# EAGLE design pixel-clock (EAGLE 7.0.0)
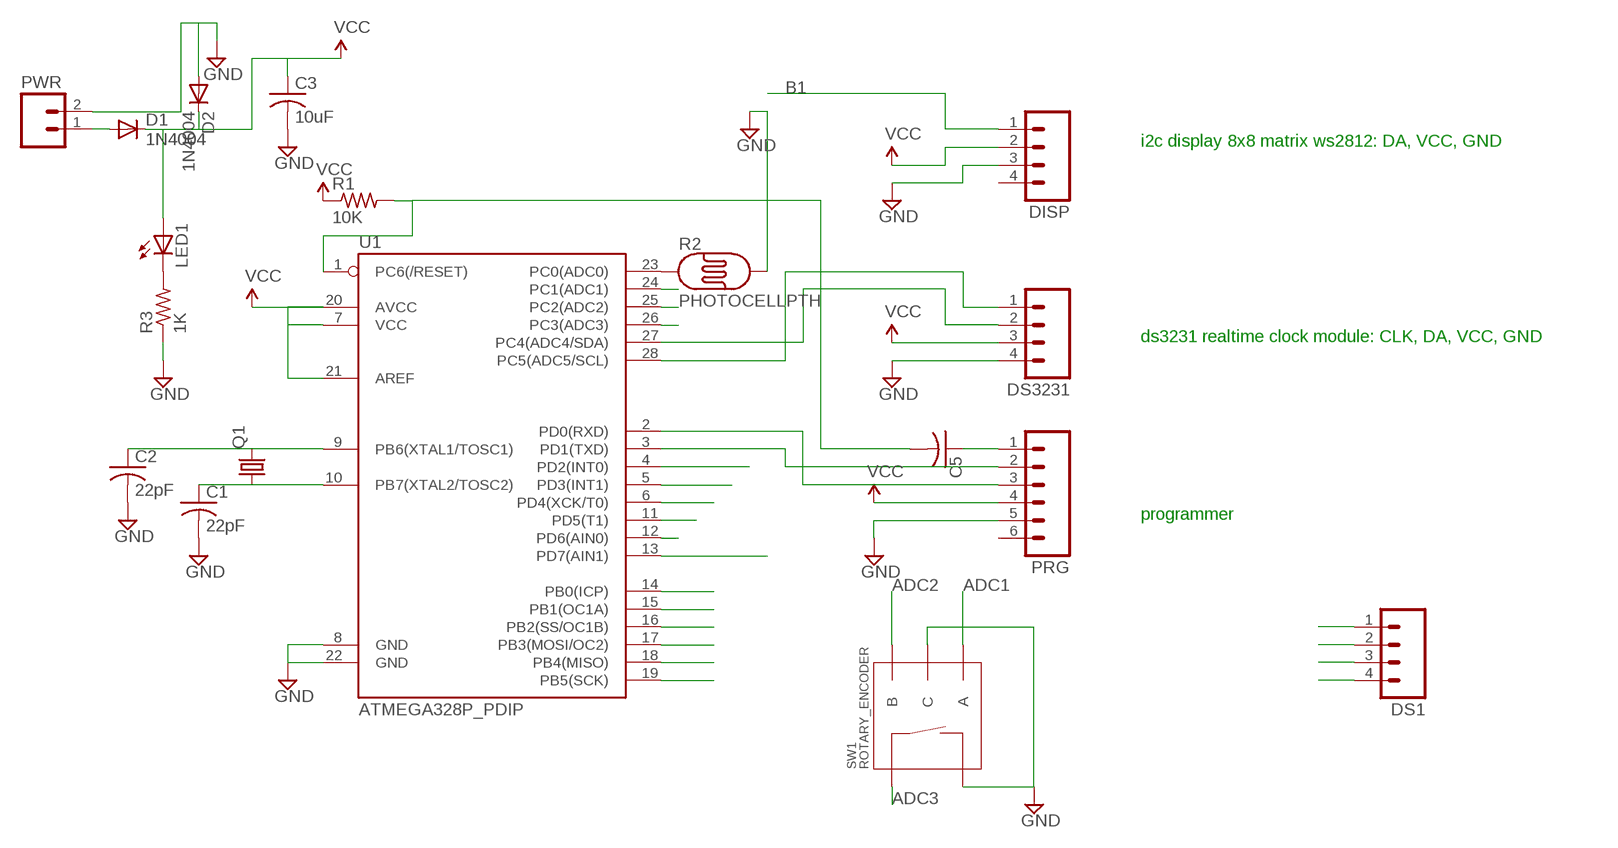
[diagram p0: schematic, sheet 1]

## Parts
C1  22pF  C-US050-024X044  [C050-024X044]
C2  22pF  C-US050-024X044  [C050-024X044]
C3  10uF  C-US025-025X050  [C025-025X050]
C5  C-US025-025X050  [C025-025X050]
D1  1N4004  [DO41-10]
D2  1N4004  [DO41-10]
DISP  M04PTH  [1X04]
DS1  M04PTH  [1X04]
DS3231  M04PTH  [1X04]
LED1  LED3MM  [LED3MM]
PRG  M06SILK_FEMALE_PTH  [1X06]
PWR  M02PTH3  [1X02_LONGPADS]
Q1  CRYSTALHC49S  [HC49/S]
R1  10K  R-US_0207/9  [0207/9]
R2  PHOTOCELLPTH  [PHOTOCELL]
R3  1K  R-US_0207/9  [0207/9]
SW1  ROTARY_ENCODER  [ROTARY_ENC_PLAIN]
U1  ATMEGA328P_PDIP  [DIL28-3]

## Nets
ADC1: SW1.A U1.24(PC1(ADC1))
ADC2: SW1.B U1.25(PC2(ADC2))
ADC3: SW1.SW+ U1.26(PC3(ADC3))
B0: DS1.1 U1.14(PB0(ICP))
B1: DISP.1 U1.15(PB1(OC1A))
B2: U1.16(PB2(SS/OC1B))
B3: U1.17(PB3(MOSI/OC2))
B4: U1.18(PB4(MISO))
B5: U1.19(PB5(SCK))
D0: PRG.3 U1.2(PD0(RXD))
D1: PRG.2 U1.3(PD1(TXD))
D2: U1.4(PD2(INT0))
D3: U1.5(PD3(INT1))
D4: U1.6(PD4(XCK/T0))
D5: U1.11(PD5(T1))
D6: DS1.3 U1.12(PD6(AIN0))
D7: DS1.2 U1.13(PD7(AIN1))
GND: C1.2 C2.2 C3.2 D2.A DISP.3 DS1.4 DS3231.4 PRG.5 PWR.2 R2.2 R3.1 SW1.C SW1.SW- U1.8(GND) U1.22(GND)
N$1: DS3231.1 U1.28(PC5(ADC5/SCL))
N$2: DS3231.2 U1.27(PC4(ADC4/SDA))
N$3: R2.1 U1.23(PC0(ADC0))
N$4: C2.1 Q1.2 U1.9(PB6(XTAL1/TOSC1))
N$5: C1.1 Q1.1 U1.10(PB7(XTAL2/TOSC2))
N$6: D1.A PWR.1
N$7: LED1.K(C) R3.2
N$12: C5.1 PRG.1
N$13: C5.2 R1.2 U1.1(PC6(/RESET))
VCC: C3.1 D1.C D2.C DISP.2 DS3231.3 LED1.A PRG.4 R1.1 U1.7(VCC) U1.20(AVCC) U1.21(AREF)
Unconnected: DISP.4 PRG.6

## Notes on the sheet
- i2c display 8x8 matrix ws2812: DA, VCC, GND
- ds3231 realtime clock module: CLK, DA, VCC, GND
- programmer

## Library data of the parts
C1-C3 C5 = adafruit:C-US: CAPACITOR, American symbol
D1 D2 = adafruit:1N4004: DIODE General purpose 1N400x type rectifier (With bigger pads) http://www.ladyada.net/library/pcb/eaglelibrary.html
DISP DS1 DS3231 = SparkFun-Connectors:M04: Header 4 Standard 4-pin 0.1" header. Use with straight break away headers (SKU : PRT-00116), right angle break away headers (PRT-00553), swiss pins (PRT-00743), machine pins (PRT-00117), and female headers (PRT-00115). Molex polarized connector foot print use with SKU : PRT-08231 with associated crimp pins and housings. 1MM SMD Version SKU: PRT-10208
LED1 = adafruit:LED: LED OSRAM: - CHIPLED LG R971, LG N971, LY N971, LG Q971, LY Q971, LO R971, LY R971 LH N974, LH R974 LS Q976, LO Q976, LY Q976 LO Q996 - Hyper CHIPLED LW Q18S LB Q993, LB Q99A, LB R99A - SideLED LS A670, LO A670, LY A670, LG A670, LP A670 LB A673, LV A673, LT A673, LW A673 LH A674 LY A675 LS A676, LA A676, LO A676, LY A676, LW A676 LS A679, LY A679, LG A679 - Hyper Micro SIDELED® LS Y876, LA Y876, LO Y876, LY Y876 LT Y87S - SmartLED LW L88C, LW L88S LB L89C, LB L89S, LG L890 LS L89K, LO L89K, LY L89K LS L896, LA L896, LO L896, LY L896 - TOPLED LS T670, LO T670, LY T670, LG T670, LP T670 LSG T670, LSP T670, LSY T670, LOP T670, LYG T670 LG T671, LOG T671, LSG T671 LB T673, LV T673, LT T673, LW T673 LH T674 LS T676, LA T676, LO T676, LY T676, LB T676, LH T676, LSB T676, LW T676 LB T67C, LV T67C, LT T67C, LS T67K, LO T67K, LY T67K, LW E67C LS E67B, LA E67B, LO E67B, LY E67B, LB E67C, LV E67C, LT E67C LW T67C LS T679, LY T679, LG T679 LS T770, LO T770, LY T770, LG T770, LP T770 LB T773, LV T773, LT T773, LW T773 LH T774 LS E675, LA E675, LY E675, LS T675 LS T776, LA T776, LO T776, LY T776, LB T776 LHGB T686 LT T68C, LB T68C - Hyper Mini TOPLED® LB M676 - Mini TOPLED Santana® LG M470 LS M47K, LO M47K, LY M47K Source: http://www.osram.convergy.de/
PRG = jack-eagle:M06: Header 6 Standard 6-pin 0.1" header. Use with straight break away headers (SKU : PRT-00116), right angle break away headers (PRT-00553), swiss pins (PRT-00743), machine pins (PRT-00117), and female headers (PRT-00115). Molex polarized connector foot print use with SKU : PRT-08094 with associated crimp pins and housings. NOTES ON THE VARIANTS LOCK and LOCK_LONGPADS... This footprint was designed to help hold the alignment of a through-hole component (i.e. 6-pin header) while soldering it into place. You may notice that each hole has been shifted either up or down by 0.005 of an inch from it's more standard position (which is a perfectly straight line). This slight alteration caused the pins (the squares in the middle) to touch the edges of the holes. Because they are alternating, it causes a "brace" to hold the component in place. 0.005 has proven to be the perfect amount of "off-center" position when using our standard breakaway headers. Although looks a little odd when you look at the bare footprint, once you have a header in there, the alteration is very hard to notice. Also,if you push a header all the way into place, it is covered up entirely on the bottom side. This idea of altering the position of holes to aid alignment will be further integrated into the Sparkfun Library for other footprints. It can help hold any component with 3 or more connection pins.; PROD_ID: CONN-08437
PWR = SparkFun-Connectors:M02: Standard 2-pin 0.1" header. Use with - straight break away headers ( PRT-00116) - right angle break away headers (PRT-00553) - swiss pins (PRT-00743) - machine pins (PRT-00117) - female headers (PRT-00115) Molex polarized connector foot print use with: PRT-08233 with associated crimp pins and housings. 2.54_SCREWTERM for use with PRT-10571. 3.5mm Screw Terminal footprints for PRT-08084 5mm Screw Terminal footprints for use with PRT-08432
Q1 = adafruit:CRYSTAL: CRYSTAL; OC_FARNELL: 1667008; OC_NEWARK: unknown
R1 R3 = adafruit:R-US_: RESISTOR, American symbol
R2 = SparkFun-Sensors:PHOTOCELL: CdS photoresistor. This is a low cost way to detect light levels. Resistance decreases with more incoming light. SparkFun SKU: SEN-09088
SW1 = jack-eagle:ROTARY_ENCODER: Simple no LED rotary encoder Example: COM-09117
U1 = SparkFun-DigitalIC:ATMEGA328P_PDIP: uC used in the Arduino 32kb flash, 1k EEPROM, 2k SRAM This is the through-hole version of this chip.

## Board
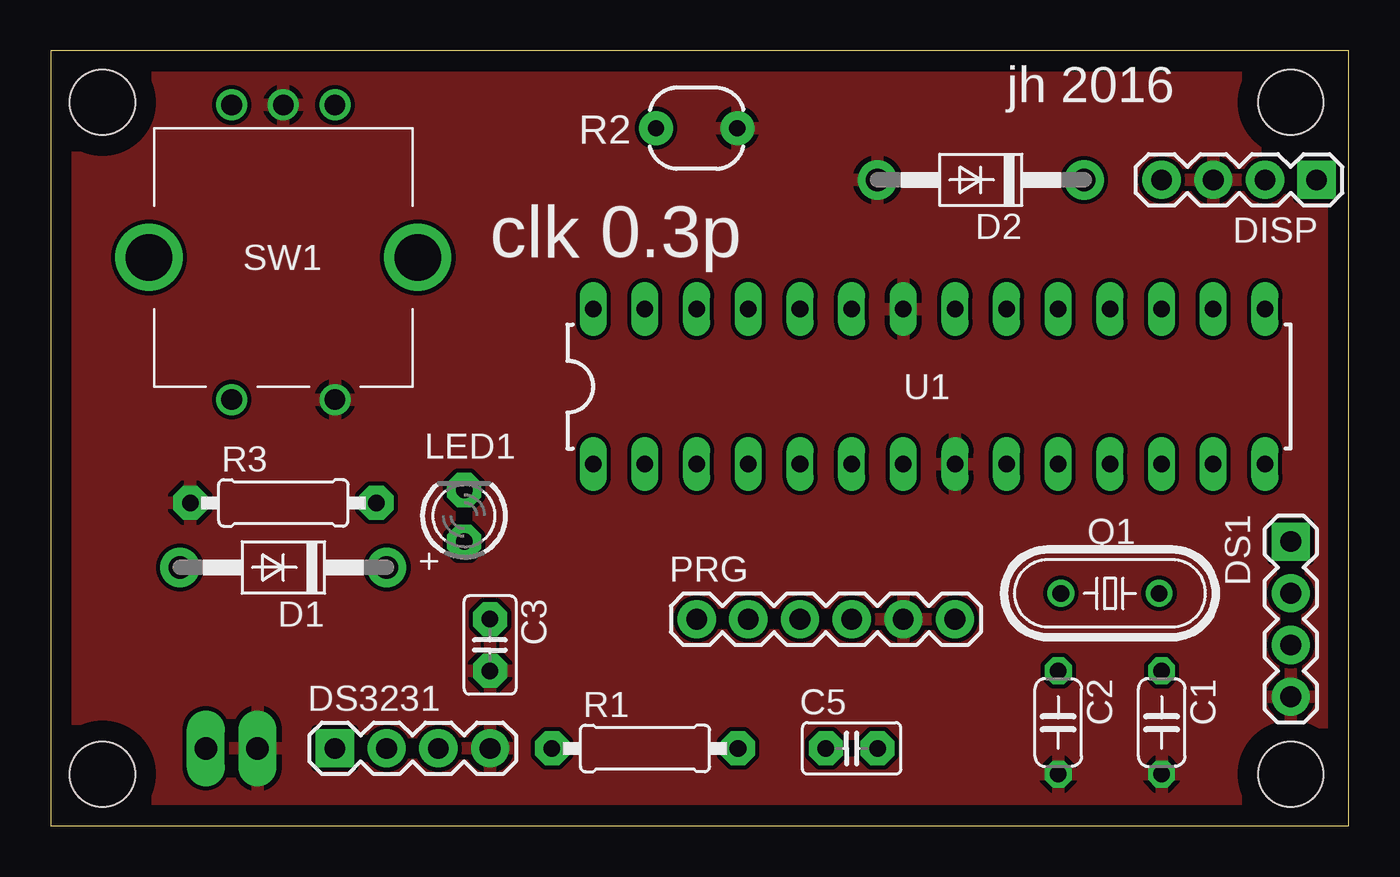
[diagram p1: board, top side]
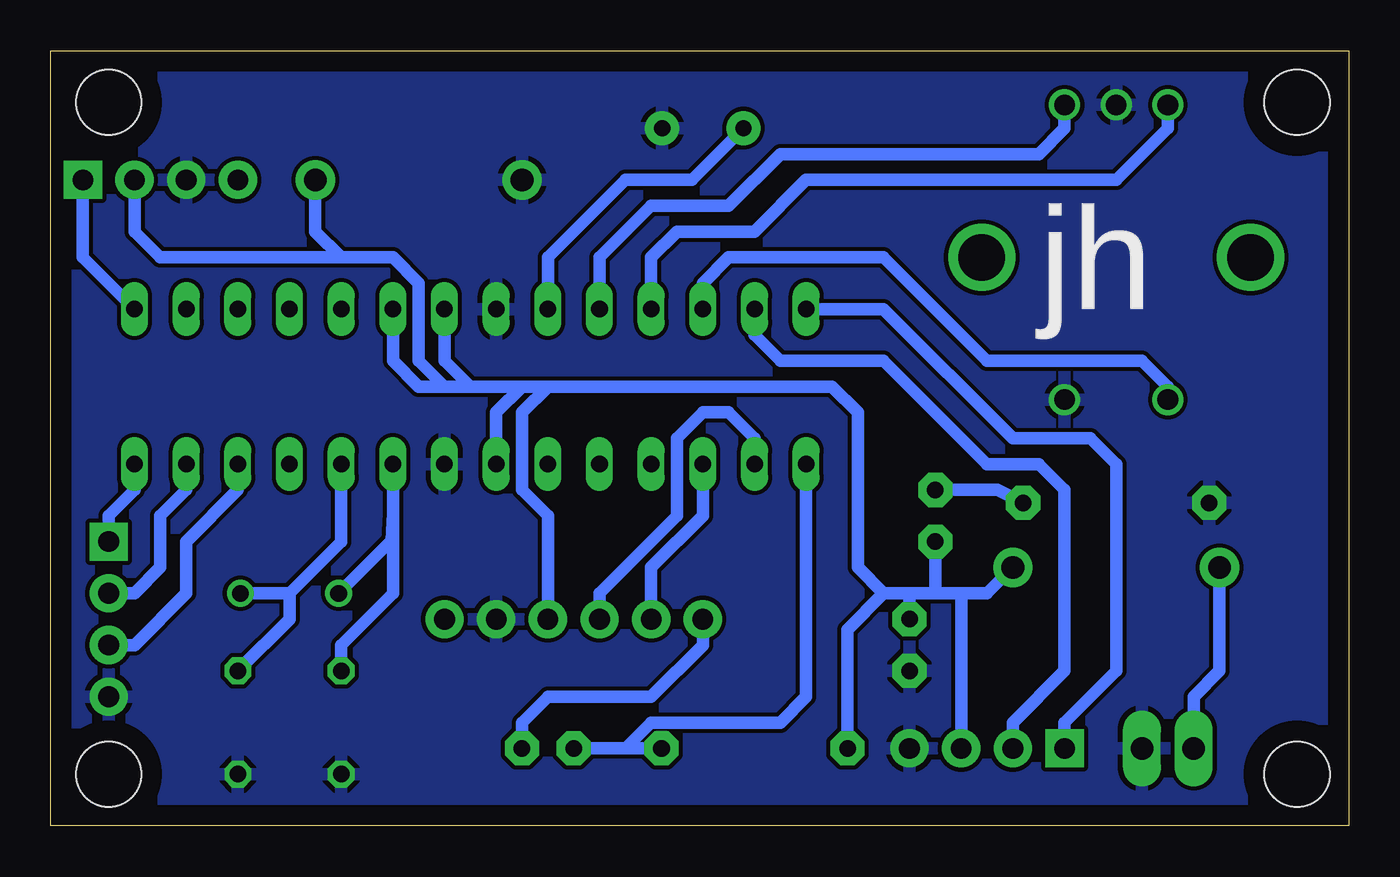
[diagram p2: board, bottom side, seen from below]

Size 63.8 x 38.09 mm. Coordinates in mm from the lower left corner, seen from the top.
Outline: 0,0 63.8,0 63.8,38.09 0,38.09 0,0
Copper layers (1*16): Top 0.035mm / dielectric 1.5mm / Bottom 0.035mm
Design rules "default": minimum track width 10mil, minimum drill 24mil, track to track 8mil, track to pad 8mil, pad to pad 8mil, via to via 8mil, smd to smd 8mil, copper to edge 40mil, drill to drill 8mil, minimum pad ring 10mil, minimum via ring 8mil, stop-mask expansion 4mil, vias tented up to drill 0mil, thermal gap 10mil
Holes 3.2 mm at 2.54,35.56 2.54,2.54 60.96,2.54 60.96,35.56

### Footprints (pad centres in the part's own frame; a part is rotated, then mirrored left to right if it is on the bottom)
C050-024X044 = drill 0.813 octagon: 1 -2.54,0; 2 2.54,0
C025-025X050 = drill 0.813 pad 1.676 octagon: 1 -1.27,0; 2 1.27,0
DO41-10 = drill 1.118 pad 1.93: A 5.08,0; C -5.08,0
1X04 = drill 1.016 pad 1.88 square: 1 0,0 | drill 1.016 pad 1.88: 2 2.54,0; 3 5.08,0; 4 7.62,0
LED3MM = drill 0.813 pad 1.676 octagon: A -1.27,0; K 1.27,0
1X06 = drill 1.016 pad 1.88: 1 0,0; 2 2.54,0; 3 5.08,0; 4 7.62,0; 5 10.16,0; 6 12.7,0
1X02_LONGPADS = drill 1.118 pad 1.88 long: 1 0,0; 2 2.54,0
HC49/S = drill 0.813: 1 -2.413,0; 2 2.413,0
0207/9 = drill 0.813 pad 1.676 octagon: 1 -4.572,0; 2 4.572,0
PHOTOCELL = drill 0.8 pad 1.676: 1 -2,0; 2 2,0
ROTARY_ENC_PLAIN = drill 1.016: A 7.493,-2.54; B 7.493,2.54; C 7.493,0; SW+ -6.985,2.54; SW- -6.985,-2.54 | drill 2.286: P$3 0,6.604; P$4 0,-6.604
DIL28-3 = drill 0.813 long: 1 -16.51,-3.81; 2 -13.97,-3.81; 3 -11.43,-3.81; 4 -8.89,-3.81; 5 -6.35,-3.81; 6 -3.81,-3.81; 7 -1.27,-3.81; 8 1.27,-3.81; 9 3.81,-3.81; 10 6.35,-3.81; 11 8.89,-3.81; 12 11.43,-3.81; 13 13.97,-3.81; 14 16.51,-3.81; 15 16.51,3.81; 16 13.97,3.81; 17 11.43,3.81; 18 8.89,3.81; 19 6.35,3.81; 20 3.81,3.81; 21 1.27,3.81; 22 -1.27,3.81; 23 -3.81,3.81; 24 -6.35,3.81; 25 -8.89,3.81; 26 -11.43,3.81; 27 -13.97,3.81; 28 -16.51,3.81

### Placement (x,y rotation side)
C1  54.61,5.08 270 top
C2  49.53,5.08 270 top
C3  21.59,8.89 270 top
C5  39.37,3.81 180 top
D1  11.43,12.7 180 top
D2  45.72,31.75 180 top
DISP  62.23,31.75 180 top
DS1  60.96,13.97 270 top
DS3231  13.97,3.81 0 top
LED1  20.32,15.24 90 top
PRG  31.75,10.16 0 top
PWR  7.62,3.81 0 top
Q1  52.07,11.43 180 top
R1  29.21,3.81 0 top
R2  31.75,34.29 0 top
R3  11.43,15.88 0 top
SW1  11.43,27.94 90 top
U1  43.18,21.59 0 top

### Tracks (layer width: path | path; a pad name or v marks a point on that pad's centre or on a via)
ADC1
  Bottom 0.61: SW1.A 13.97,34.29 15.24,33.02 27.94,33.02 30.48,30.48 34.29,30.48 36.83,27.94 U1.24
ADC2
  Bottom 0.61: SW1.B 8.89,34.29 11.43,31.75 26.67,31.75 29.21,29.21 33.02,29.21 34.29,27.94 U1.25
ADC3
  Bottom 0.61: SW1.SW+ 8.89,21.59 10.16,22.86 17.78,22.86 22.86,27.94 30.48,27.94 31.75,26.67 U1.26
B0
  Bottom 0.61: DS1.1 60.96,15.24 59.69,16.51 U1.14
B1
  Bottom 0.61: DISP.1 62.23,27.94 U1.15
D0
  Bottom 0.61: PRG.3 36.83,11.43 33.02,15.24 33.02,19.05 31.75,20.32 30.48,20.32 29.21,19.05 U1.2
D1
  Bottom 0.61: PRG.2 34.29,12.7 31.75,15.24 U1.3
D6
  Bottom 0.61: DS1.3 59.69,8.89 57.15,11.43 57.15,13.97 54.61,16.51 U1.12
D7
  Bottom 0.61: DS1.2 59.69,11.43 58.42,12.7 58.42,15.24 57.15,16.51 U1.13
GND
  pour Bottom: -2.54,40.64 66.04,40.64 66.04,-2.54 -2.54,-2.54
  pour Top: -3.81,40.64 67.31,40.64 67.31,-3.81 -3.81,-3.81
N$1
  Bottom 0.61: U1.28 22.86,25.4 16.51,19.05 12.7,19.05 11.43,17.78 11.43,7.62 13.97,5.08 DS3231.1
N$2
  Bottom 0.61: U1.27 29.21,24.13 27.94,22.86 22.86,22.86 17.78,17.78 15.24,17.78 13.97,16.51 13.97,7.62 16.51,5.08 DS3231.2
N$3
  Bottom 0.61: U1.23 39.37,27.94 35.56,31.75 32.29,31.75 R2.1
N$4
  Bottom 0.61: U1.9 46.99,15.37 47.05,14.03 | 47.05,14.03 Q1.2 | C2.1 49.53,8.89 46.99,11.43 46.99,15.24 47.05,14.03
N$5
  Bottom 0.61: U1.10 49.53,13.97 52.07,11.43 | 52.07,11.43 Q1.1 | C1.1 52.07,10.16 52.07,11.43
N$6
  Bottom 0.61: PWR.1 7.62,6.35 6.35,7.62 D1.A
N$7
  Bottom 0.61: R3.2 17.27,16.51 LED1.K
N$12
  Bottom 0.61: PRG.1 31.75,8.89 34.29,6.35 39.37,6.35 40.64,5.08 C5.1
N$13
  Bottom 0.61: U1.1 26.67,6.35 27.94,5.08 34.29,5.08 35.56,3.81 | R1.2 35.56,3.81 | 35.56,3.81 C5.2
VCC
  Bottom 0.61: LED1.A 20.32,11.43 | R1.1 24.64,9.65 22.86,11.43 | 22.86,11.43 21.59,11.43 | 21.59,11.43 20.32,11.43 | DISP.2 59.69,29.21 58.42,27.94 49.53,27.94 | 49.53,27.94 46.99,27.94 45.72,26.67 45.72,22.86 44.45,21.59 | 44.45,21.59 43.18,21.59 | 43.18,21.59 40.64,21.59 | 40.64,21.59 39.37,21.59 | 39.37,21.59 25.4,21.59 24.13,20.32 24.13,12.7 22.86,11.43 | U1.20 46.99,22.86 45.72,21.59 44.45,21.59 | U1.21 44.45,22.86 43.18,21.59 | U1.7 41.91,20.32 40.64,21.59 | PRG.4 39.37,15.24 40.64,16.51 40.64,20.32 39.37,21.59 | 19.05,11.43 20.32,11.43 | DS3231.3 19.05,11.43 | C3.1 21.59,11.43 | D2.C 50.8,29.21 49.53,27.94 | 19.05,11.43 17.78,11.43 D1.C

### Text on the board
tPlace: jh 2016 | clk 0.3p
bPlace: jh